# EAGLE design main (EAGLE 7.5.0)
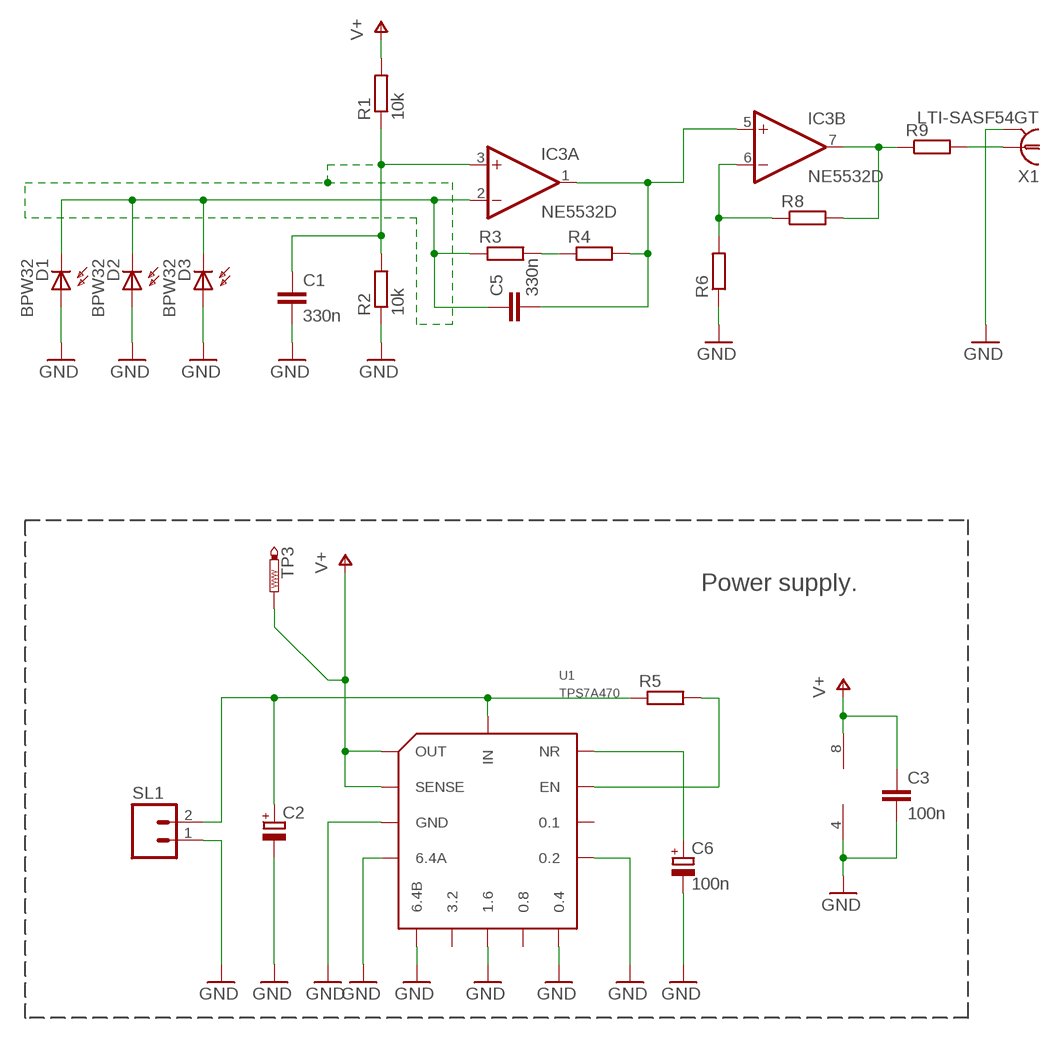
[diagram p0: schematic, sheet 1]

## Parts
C1  330n  C-EUC0805  [C0805]
C2  CPOL-EUT/3528-12R  [T/3528-12R]
C3  100n  C-EUC0805  [C0805]
C5  330n  C-EUC0805  [C0805]
C6  100n  CPOL-EUA/3216-18W  [A/3216-18W]
D1  BPW32  [BPW32]
D2  BPW32  [BPW32]
D3  BPW32  [BPW32]
IC3  NE5532D  [SO08]
R1  10k  R-EU_R0805  [R0805]
R2  10k  R-EU_R0805  [R0805]
R3  R-EU_MELF0204W  [MINI_MELF-0204W]
R4  R-EU_MELF0204W  [MINI_MELF-0204W]
R5  R-EU_M1206  [M1206]
R6  R-EU_0204/2V  [0204V]
R8  R-EU_M0805  [M0805]
R9  R-EU_0204/2V  [0204V]
SL1  M02  [02P]
TP3  PTR1TP12R  [TP12R]
U1  TPS7A470  [S-PVQFN-N20]
X1  LTI-SASF54GT  [LTI-SASF54GT]

## Nets
GND: C1.2 C2.- C3.2 C6.- D1.A D2.A D3.A IC3.4(P:V-) R2.1 R6.1 SL1.1 U1.2(GND) U1.4(6.4A) U1.5(6.4B) U1.7(GND) U1.8(1.6) U1.10(0.4) U1.11(0.2) U1.17(GND) U1.18(GND) U1.19(GND) U1.EXP(GND) X1.2 X1.3 X1.4 X1.5
N$1: C5.2 IC3.1(A:OUT) IC3.5(B:+IN) R4.2
N$2: IC3.6(B:-IN) R6.2 R8.1
N$3: R3.2 R4.1
N$4: C5.1 D1.K(C) D2.K(C) D3.K(C) IC3.2(A:-IN) R3.1
N$5: C6.+ U1.14(NR)
N$6: R5.2 U1.13(EN)
N$8: C2.+ R5.1 SL1.2 U1.15(IN) U1.16(IN)
N$9: IC3.7(B:OUT) R8.2 R9.1
N$14: C1.1 IC3.3(A:+IN) R1.1 R2.2
N$15: R9.2 X1.1
V+: C3.1 IC3.8(P:V+) R1.2 TP3.TP U1.1(OUT) U1.3(SENSE) U1.20(OUT)
Unconnected: U1.6(3.2) U1.9(0.8) U1.12(0.1)

## Notes on the sheet
- Power supply.

## Library data of the parts
C1 C3 C5 = rcl:C-EU: CAPACITOR, European symbol
C2 = resistor:CPOL-EU: POLARIZED CAPACITOR, European symbol
C6 = rcl:CPOL-EU: POLARIZED CAPACITOR, European symbol
D1-D3 = opto-trans-siemens:BPW32: PHOTO DIODE; OC_FARNELL: unknown; OC_NEWARK: unknown
IC3 = linear:NE5532: AUDIO AMPLIFIER
R1 R2 = rcl:R-EU_: RESISTOR, European symbol
R3-R6 R8 R9 = resistor:R-EU_: RESISTOR, European symbol
SL1 = con-amp-quick:M02: AMP QUICK CONNECTOR; OC_FARNELL: unknown; OC_NEWARK: unknown
TP3 = testpad:PTR1: TEST PIN
U1 = regulator-jqi:TPS7A470: Ultra-low noise LDO regulator, variable programmable output, 36V
X1 = con-coax:LTI-SASF54GT: SMA vertical PCB thrue hole jack Source: Lighthorse Technologies, inc. SASF54GT.pdf; OC_FARNELL: unknown; OC_NEWARK: unknown

## Net classes
0 signal: width 0.254 mm, drill 0.254 mm, clearance 0.254 mm
1 sensor_output: width 0.254 mm, clearance 0.381 mm
2 power_supply: width 0.559 mm

## Board
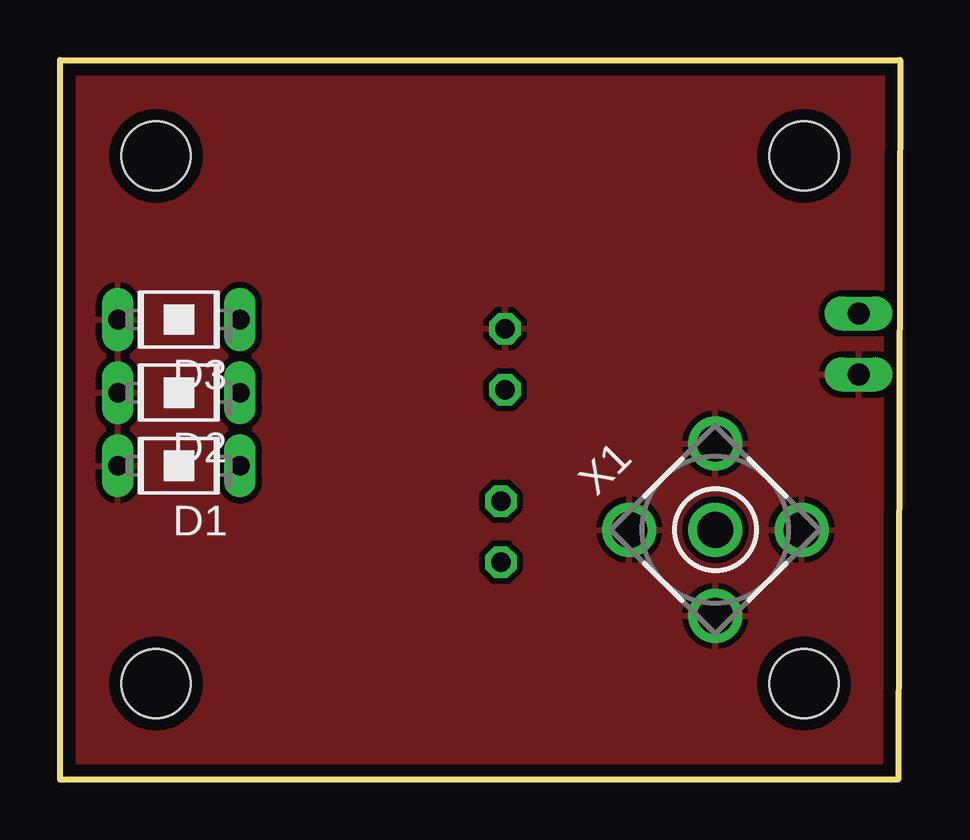
[diagram p1: board, top side]
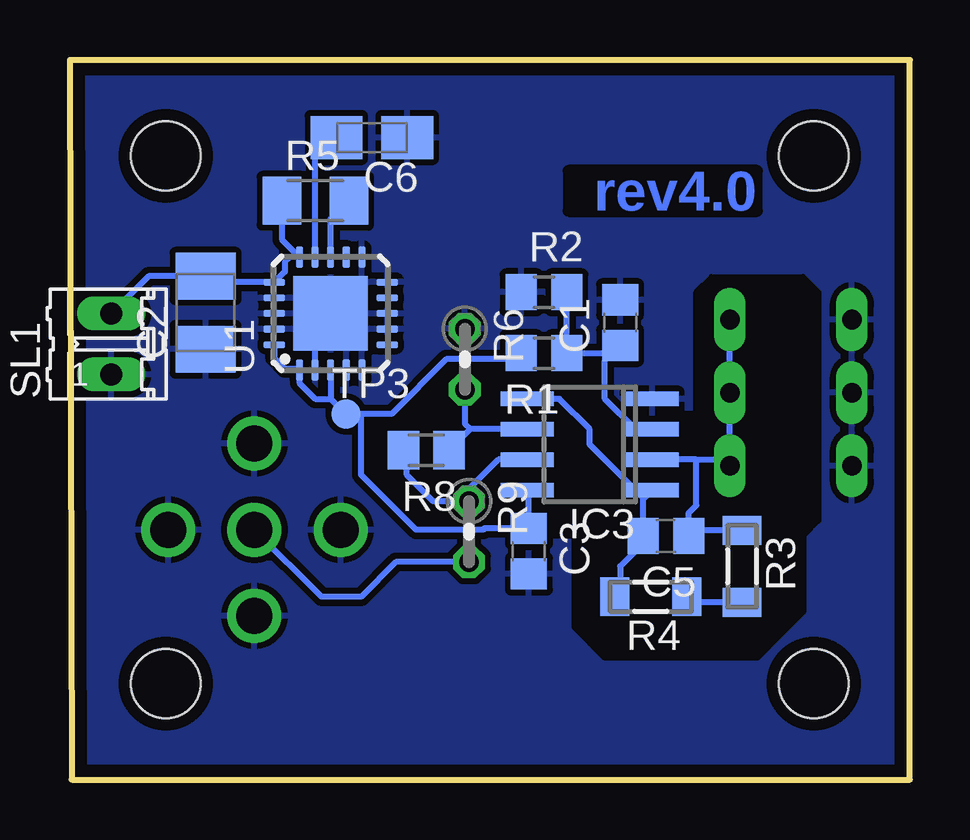
[diagram p2: board, bottom side, seen from below]

Size 35 x 30 mm. Coordinates in mm from the lower left corner, seen from the top.
Outline: 0,30 35,30 34.92,0 0,0 0,30
Copper layers (1*16): Top 0.035mm / dielectric 1.5mm / Bottom 0.035mm
Design rules "default *": minimum track width 9mil, minimum drill 24mil, track to track 10mil, track to pad 10mil, pad to pad 10mil, via to via 10mil, smd to smd 10mil, copper to edge 20mil, drill to drill 9mil, minimum pad ring 10mil, minimum via ring 8mil, stop-mask expansion 9mil, vias tented up to drill 0mil, thermal gap 10mil
Holes 2.9 mm at 4,26 31,26 31,4 4,4
bRestrict: area 3.8,5.1 to 14,21; area 13.3,10.2 to 15.2,15.2; area 8.9,14.6 to 10.2,15.2

### Footprints (pad centres in the part's own frame; a part is rotated, then mirrored left to right if it is on the bottom)
C0805 = smd 1.3 x 1.5: 1 -0.95,0; 2 0.95,0
T/3528-12R = smd 1.95 x 2.5: + 1.525,0; - -1.525,0
A/3216-18W = smd 2.15 x 1.8: + 1.475,0; - -1.475,0
BPW32 = drill 0.813 long: A 0,2.54; K 0,-2.54
SO08 = smd 0.6 x 2.2: 1 -1.905,-2.6; 2 -0.635,-2.6; 3 0.635,-2.6; 4 1.905,-2.6; 5 1.905,2.6; 6 0.635,2.6; 7 -0.635,2.6; 8 -1.905,2.6
R0805 = smd 1.3 x 1.5: 1 -0.95,0; 2 0.95,0
MINI_MELF-0204W = smd 1.2 x 1.6: 1 -1.5,0; 2 1.5,0
M1206 = smd 1.6 x 2: 1 -1.4,0; 2 1.4,0
0204V = drill 0.813 octagon: 1 -1.27,0; 2 1.27,0
M0805 = smd 1.3 x 1.6: 1 -0.95,0; 2 0.95,0
02P = drill 0.914 long: 1 -1.27,0; 2 1.27,0
TP12R = smd 1.2 x 1.2: TP 0,0
S-PVQFN-N20 = smd 0.9 x 0.3: 1 -2.35,1.3; 2 -2.35,0.65; 3 -2.35,0; 4 -2.35,-0.65; 5 -2.35,-1.3; 11 2.35,-1.3; 12 2.35,-0.65; 13 2.35,0; 14 2.35,0.65; 15 2.35,1.3 | smd 0.3 x 0.9: 6 -1.3,-2.35; 7 -0.65,-2.35; 8 0,-2.35; 9 0.65,-2.35; 10 1.3,-2.35; 16 1.3,2.35; 17 0.65,2.35; 18 0,2.35; 19 -0.65,2.35; 20 -1.3,2.35 | smd 3.1 x 3.1: EXP 0,0
LTI-SASF54GT = drill 1.5 pad 2.2: 1 0,0; 2 -2.54,2.54; 3 2.54,2.54; 4 2.54,-2.54; 5 -2.54,-2.54

### Placement (x,y rotation side)
C1  12.06,19.05 90 bottom
C2  29.34,19.46 90 bottom
C3  15.88,9.53 270 bottom
C5  10.16,10.16 180 bottom
C6  22.41,26.77 180 bottom
D1  4.95,13.08 90 top
D2  4.95,16.13 90 top
D3  4.95,19.18 90 top
IC3  13.34,13.97 90 bottom
R1  15.24,17.78 180 bottom
R2  15.24,20.32 0 bottom
R3  6.99,8.89 270 bottom
R4  10.79,7.62 180 bottom
R5  24.77,24.13 0 bottom
R6  18.54,17.53 270 bottom
R8  20.15,13.73 180 bottom
R9  18.37,10.33 270 bottom
SL1  33.27,18.16 90 bottom
TP3  23.5,15.24 0 bottom
U1  24.13,19.43 90 bottom
X1  27.3,10.41 45 top

### Tracks (layer width: path | path; a pad name or v marks a point on that pad's centre or on a via)
GND
  Bottom 0.254: U1.2 24.78,18.78 U1.EXP
  pour Bottom: 0,30 0,0 34.92,0 35,30
  pour Top: 0,30 0,0 34.92,0 35,30
N$1
  Bottom 0.254: 11.11,11.69 C5.2 11.11,9.85 12.06,8.89 12.06,7.85 R4.2 | 11.11,11.69 IC3.1 | 11.11,11.69 11.11,11.74 13.34,13.97 13.34,14.61 14.61,15.88 IC3.5
N$2
  Bottom 0.254: IC3.6 18.32,14.61 | 18.32,14.61 R8.1 | R6.2 18.54,14.82 18.32,14.61
N$3
  Bottom 0.254: R3.2 9.06,7.39 R4.1
N$4
  Bottom 0.254: D1.K 7.49,13.97 | 7.49,13.97 D2.K D3.K | 8.89,13.34 8.89,11.43 9.21,11.11 C5.1 8.98,10.39 R3.1 | 8.89,13.34 IC3.2 | 8.89,13.34 8.13,13.34 7.49,13.97
N$5
  Bottom 0.254: U1.14 24.78,27.14 C6.+
N$6
  Bottom 0.254: U1.13 24.13,23.36 R5.2
N$8
  Bottom 0.254: R5.1 26.16,22.52 U1.15 25.84,21.78 26.04,21.59 26.04,21.18 U1.16 28.42,20.73 C2.+ 31.72,20.99 SL1.2
N$9
  Bottom 0.254: IC3.7 17.14,13.34 18.41,12.06 18.41,11.65 R9.1 19.86,11.6 20.95,12.7 20.95,13.59 R8.2
N$14
  Bottom 0.254: R2.2 R1.1 12.38,17.78 C1.1 12.7,17.46 12.7,15.88 11.43,14.61 IC3.3
N$15
  Bottom 0.254: R9.2 21.42,9.06 22.86,7.62 24.51,7.62 X1.1
V+
  Bottom 0.254: U1.20 26.48,17.59 26.04,17.14 25.49,17.14 U1.1 25.43,16.54 24.77,15.88 24.13,15.88 | IC3.8 15.88,12.01 C3.1 17.72,10.47 17.78,10.41 20.57,10.41 22.86,12.7 22.86,15.24 | 22.86,15.24 21.59,15.24 19.3,17.53 16.44,17.53 R1.2 | U1.3 24.13,15.88 | 22.86,15.24 TP3.TP 24.13,15.88

### Text on the board
Bottom: rev4.0